# EAGLE design TimeLord-R2 (EAGLE 6.5.0)
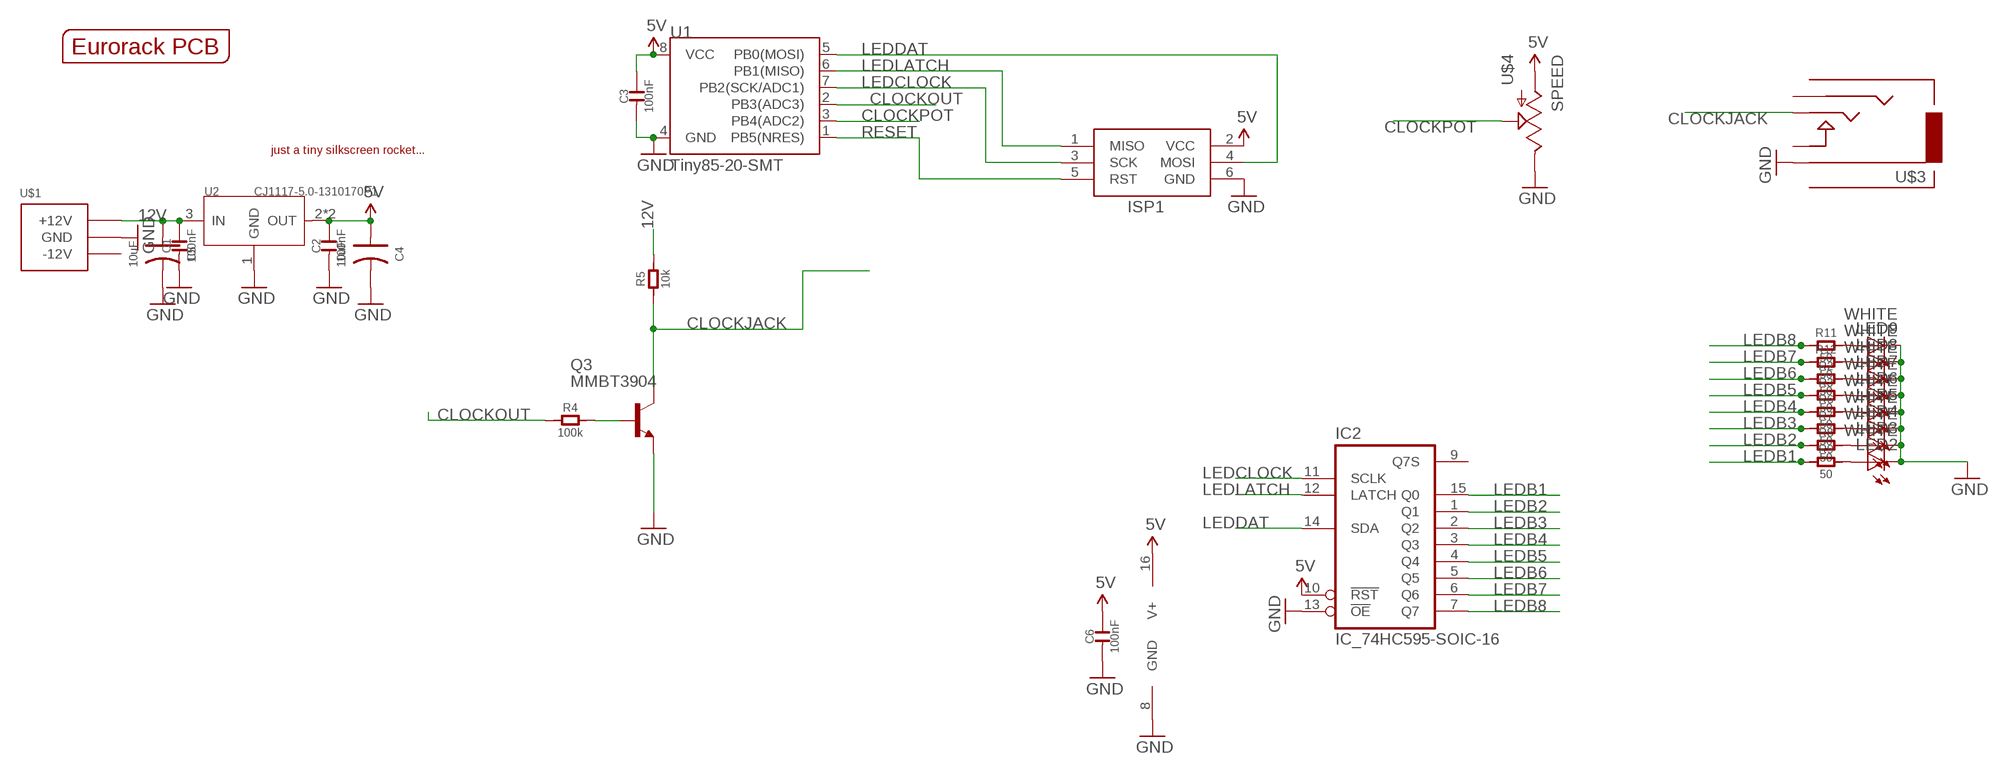
[diagram p0: schematic, sheet 1]

## Parts
C1  100nF  C-0603  [C0603]
C2  100nF  C-0603  [C0603]
C3  100nF  C-0603  [C0603]
C4  10uF  C-POLAR-A  [AVX-A]
C5  10uF  C-POLAR-A  [AVX-A]
C6  100nF  C-0603  [C0603]
IC2  IC_74HC595-SOIC-16  [SOIC-16]
ISP1  AVRISP-6  [AVRISP]
LED2  WHITE  LED3MM  [LED3MM]
LED3  WHITE  LED3MM  [LED3MM]
LED4  WHITE  LED3MM  [LED3MM]
LED5  WHITE  LED3MM  [LED3MM]
LED6  WHITE  LED3MM  [LED3MM]
LED7  WHITE  LED3MM  [LED3MM]
LED8  WHITE  LED3MM  [LED3MM]
LED9  WHITE  LED3MM  [LED3MM]
Q3  MMBT3904  MMBT3904LT1-NPN-SOT23-BEC  [SOT23-BEC]
R2  50  R-0603  [R0603]
R3  50  R-0603  [R0603]
R4  100k  R-0603  [R0603]
R5  10k  R-0603  [R0603]
R6  50  R-0603  [R0603]
R7  50  R-0603  [R0603]
R8  50  R-0603  [R0603]
R9  50  R-0603  [R0603]
R11  50  R-0603  [R0603]
R12  50  R-0603  [R0603]
U1  Tiny85-20-SMT  ATTINY45TINY85-20-SMT  [SO08-EIAJ]
U2  CJ1117-5.0-1310170P1  [SOT223]
U$1  POWER_SIMPLE10-OTHERSIDE  [POWER_10_LABELSOTHERSIDE]
U$2  EURORACK_PCB4HP  [EURORACK4HPPCB]
U$3  CLOCK  AUDIO-JACKOUTPUT  [3.5MM-JACK-SWITCH-13MM-OUTPUT]
U$4  SPEED  POTZEPHPOT  [OG-POTS_ALPS_POT_VERTICAL]
U$5  JUSTATINYROCKET  [JUSTATINYROCKET]

## Nets
5V: C2.2 C3.2 C4.+ C6.2 IC2.10(!RST) IC2.16(V+) ISP1.2(VCC) U1.8(VCC) U2.2(OUT) U2.TER(OUT) U$4.P$3(A)
12V: C1.2 C5.+ R5.2 U2.3(IN) U$1.9(+12V) U$1.10(+12V)
CLOCKJACK: Q3.C R5.1 U$3.TIP@1(TIP) U$3.TIP@2(TIP)
CLOCKOUT: R4.1 U1.2(PB3(ADC3))
CLOCKPOT: U1.3(PB4(ADC2)) U$4.P$2(S)
GND: C1.1 C2.1 C3.1 C4.- C5.- C6.1 IC2.8(GND) IC2.13(!OE) ISP1.6(GND) LED2.K(C) LED3.K(C) LED4.K(C) LED5.K(C) LED6.K(C) LED7.K(C) LED8.K(C) LED9.K(C) Q3.E U1.4(GND) U2.1(GND) U$1.3(GND) U$1.4(GND) U$1.5(GND) U$1.6(GND) U$1.7(GND) U$1.8(GND) U$3.RING@1(RING) U$3.RING@2(RING) U$4.P$1(E)
LEDB1: IC2.15(Q0) R9.1
LEDB2: IC2.1(Q1) R8.1
LEDB3: IC2.2(Q2) R7.1
LEDB4: IC2.3(Q3) R6.1
LEDB5: IC2.4(Q4) R3.1
LEDB6: IC2.5(Q5) R2.1
LEDB7: IC2.6(Q6) R12.1
LEDB8: IC2.7(Q7) R11.1
LEDCLOCK: IC2.11(SCLK) ISP1.3(SCK) U1.7(PB2(SCK/ADC1))
LEDDAT: IC2.14(SDA) ISP1.4(MOSI) U1.5(PB0(MOSI))
LEDLATCH: IC2.12(LATCH) ISP1.1(MISO) U1.6(PB1(MISO))
N$1: LED9.A R11.2
N$2: LED8.A R12.2
N$3: LED7.A R2.2
N$4: LED6.A R3.2
N$5: LED5.A R6.2
N$6: LED4.A R7.2
N$7: LED3.A R8.2
N$8: LED2.A R9.2
N$9: Q3.B R4.2
RESET: ISP1.5(RST) U1.1(PB5(NRES))
Unconnected: IC2.9(Q7S) U$1.1(-12V) U$1.2(-12V) U$3.SECOND@1(SECOND) U$3.SECOND@2(SECOND) U$3.SWITCH@1(SWITCH) U$3.SWITCH@2(SWITCH)

## Library data of the parts
C1-C3 C6 = OPL:C*
C4 C5 = OPL:C-POLAR*
IC2 = dp_devices:IC_74HC595: 8-bit serial-in parallel out shift register, output latch 3-state
ISP1 = adafruit:AVRISP: AVR ISP HEADER Standard 6 pin header for AVR programming
LED2-LED9 = SparkFun-LED:LED: LEDs Standard schematic elements and footprints for 5mm, 3mm, 1206, and 0603 sized LEDs. 5mm - Spark Fun Electronics SKU : COM-00529 (and others)
Q3 = transistor:*-NPN-: NPN Transistror BF959 corrected 2008.03.06
R2-R9 R11 R12 = OPL:R*
U1 = SparkFun-DigitalIC:ATTINY45: Atmel 8-pin 2/4/8kB flash uC; PROD_ID: IC-09092
U2 = OPL:CJ1117-5.0
U$1 = EurorackModularParts:POWER_SIMPLE
U$2 = EurorackModularParts:EURORACK_PCB
U$3 = EurorackModularParts:AUDIO-JACK: Switching Mono 3.5mm Audio Jack from Erthenvar.
U$4 = EurorackModularParts:POT
U$5 = zephod-components:JUSTATINYROCKET

## Net classes
0 default: width 0.381 mm

## Board
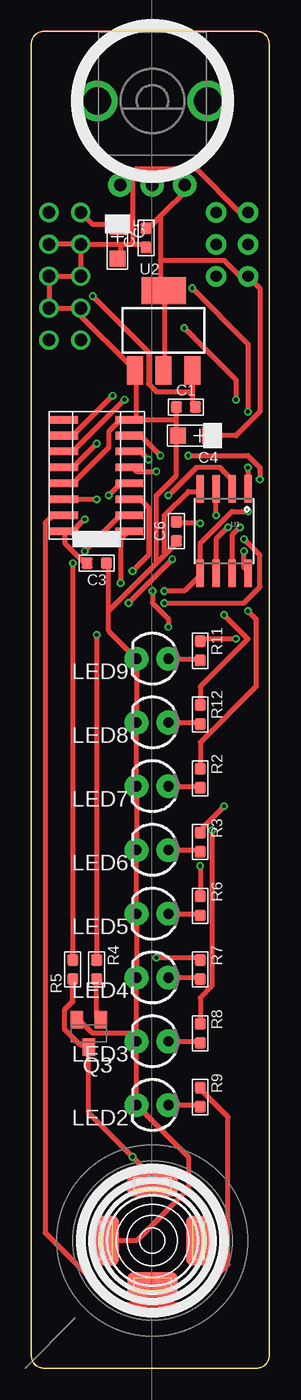
[diagram p1: board, top side]
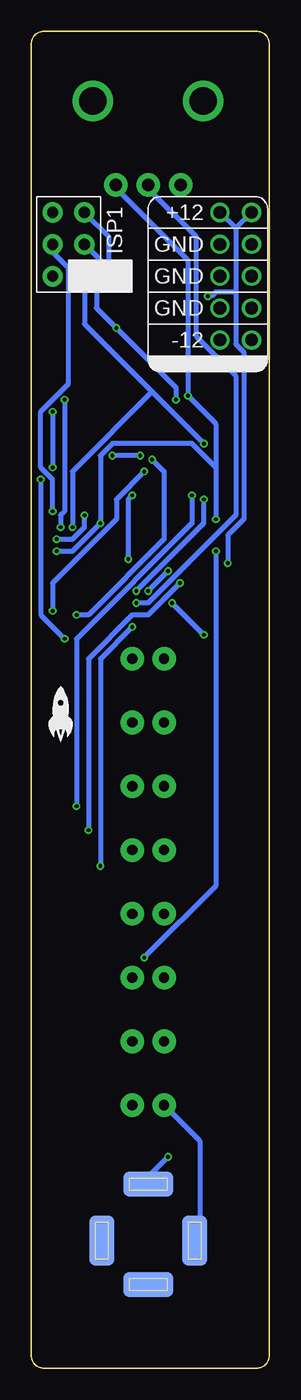
[diagram p2: board, bottom side, seen from below]

Size 18.98 x 106.5 mm. Coordinates in mm from the lower left corner, seen from the top.
Copper layers (1*16): Top 0.035mm / dielectric 1.5mm / Bottom 0.035mm
Design rules "ITEADstudio_DRC": minimum track width 6mil, minimum drill 12mil, track to track 6mil, track to pad 6mil, pad to pad 6mil, via to via 6mil, smd to smd 0mil, copper to edge 10mil, drill to drill 10mil, minimum pad ring 10mil, minimum via ring 6mil, stop-mask expansion 2mil, vias tented up to drill 100mil, thermal gap 10mil

### Footprints (pad centres in the part's own frame; a part is rotated, then mirrored left to right if it is on the bottom)
C0603 = smd 0.889 x 0.889: 1 -0.762,0; 2 0.762,0
AVX-A = smd 1.27 x 1.27: + -1.27,0; - 1.27,0
SOIC-16 = smd 0.6 x 2.2: 1 -4.445,-2.6; 2 -3.175,-2.6; 3 -1.905,-2.6; 4 -0.635,-2.6; 5 0.635,-2.6; 6 1.905,-2.6; 7 3.175,-2.6; 8 4.445,-2.6; 9 4.445,2.6; 10 3.175,2.6; 11 1.905,2.6; 12 0.635,2.6; 13 -0.635,2.6; 14 -1.905,2.6; 15 -3.175,2.6; 16 -4.445,2.6
AVRISP = drill 0.9 pad 1.626: 1 -1.27,2.54; 2 1.27,2.54; 3 -1.27,0; 4 1.27,0; 5 -1.27,-2.54; 6 1.27,-2.54
LED3MM = drill 0.813 pad 1.88: A -1.27,0; K 1.27,0
SOT23-BEC = smd 1 x 1.4: B -0.95,-1.1; C 0,1.1; E 0.95,-1.1
R0603 = smd 0.889 x 0.889: 1 -0.762,0; 2 0.762,0
SO08-EIAJ = smd 0.61 x 2.21: 1 -1.905,-3.378; 2 -0.635,-3.378; 3 0.635,-3.378; 4 1.905,-3.378; 5 1.905,3.353; 6 0.635,3.353; 7 -0.635,3.353; 8 -1.905,3.353
SOT223 = smd 1.27 x 2.286: 1 -2.286,-3.175; 2 0,-3.175; 3 2.286,-3.175 | smd 3.556 x 2.159: TER 0,3.175
POWER_10_LABELSOTHERSIDE = drill 1.016: 1 -5.08,-1.27; 2 -5.08,1.27; 3 -2.54,-1.27; 4 -2.54,1.27; 5 0,-1.27; 6 0,1.27; 7 2.54,-1.27; 8 2.54,1.27; 9 5.08,-1.27; 10 5.08,1.27
3.5MM-JACK-SWITCH-13MM-OUTPUT = smd 2 x 4: RING@1 -3.7,0; SWITCH@1 3.7,0 | smd 2 x 4 bottom: RING@2 -3.7,0; SWITCH@2 3.7,0 | smd 4 x 2: SECOND@1 0,-3.5; TIP@1 0,4.5 | smd 4 x 2 bottom: SECOND@2 0,-3.5; TIP@2 0,4.5
OG-POTS_ALPS_POT_VERTICAL = drill 1 pad 1.88: P$1 -2.58,-6.7; P$2 0,-6.7; P$3 2.58,-6.7 | drill 2.2 pad 3.175: P$4 4.4,0; P$5 -4.4,0

### Placement (x,y rotation side)
C1  12.33,76.58 0 top
C2  9.15,90.04 90 top
C3  5.21,64.14 180 top
C4  12.96,74.3 180 top
C5  6.87,89.66 270 top
C6  11.56,66.67 90 top
IC2  5.21,71.12 90 top
ISP1  16.01,89.53 180 bottom
LED2  9.66,20.95 180 top
LED3  9.66,26.04 180 top
LED4  9.66,31.11 180 top
LED5  9.66,36.2 180 top
LED6  9.66,41.27 180 top
LED7  9.66,46.35 180 top
LED8  9.66,51.44 180 top
LED9  9.66,56.52 180 top
Q3  4.58,26.67 180 top
R2  13.47,46.99 270 top
R3  13.47,41.91 270 top
R4  5.21,31.75 270 top
R5  3.31,31.75 90 top
R6  13.47,36.83 270 top
R7  13.47,31.75 270 top
R8  13.47,26.67 270 top
R9  13.47,21.59 270 top
R11  13.47,57.15 270 top
R12  13.47,52.07 270 top
U1  15.38,66.67 180 top
U2  10.55,82.68 0 top
U$1  2.67,87 90 bottom
U$2  -0.5,0 0 top
U$3  9.66,10.16 0 top
U$4  9.66,100.97 0 top
U$5  16.64,52.07 0 bottom

### Tracks (layer width: path | path; a pad name or v marks a point on that pad's centre or on a via)
5V  (via drill 0.3)
  Top 0.381: C4.+ 16.33,74.3 18.23,76.2 18.23,86.04 ISP1.2 16.64,87 15.38,88.27 10.29,88.27 | U2.2 10.61,79.69 10.61,85.72 U2.TER 10.29,86.04 10.29,88.27 | v13.47,67.31 11.56,67.31 C6.2 | v16.96,65.09 16.96,63.82 17.28,63.5 U1.8 | 2.67,66.67 2.67,65.72 4.26,64.14 C3.2 | 10.29,91.76 12.52,93.98 U$4.P$3 | 10.29,91.76 9.34,90.81 C2.2 | IC2.10 3.31,74.3 v6.49,77.47 | 2.67,66.67 3.31,66.67 v4.26,67.63 | 2.67,66.67 IC2.16 | 10.29,91.76 10.29,88.27
  Bottom 0.381: v16.96,65.09 15.69,65.09 v13.47,67.31 13.47,72.71 12.52,73.66 6.17,73.66 4.26,71.75 | U$4.P$3 12.2,93.98 6.49,88.27 v6.49,77.47 4.26,75.25 4.26,71.75 | 4.26,71.75 v4.26,67.63
12V  (via drill 0.3)
  Top 0.381: U$1.10 4.9,91.12 6.8,91.12 C5.+ | U2.3 12.84,77.79 | 12.84,77.79 12.84,76.83 C1.2 | v3.31,64.14 R5.2 | 12.84,77.79 9.98,77.79 9.34,78.42 9.34,80.96 v4.9,85.41
  Bottom 0.381: v3.31,64.14 3.31,66.36 2.04,67.63 2.04,80.96 2.67,81.6 2.67,85.72 | 2.67,90.81 2.67,85.72 | U$1.9 2.67,90.81 | v4.9,85.41 4.58,85.41 4.26,85.72 2.67,85.72 | 2.67,90.81 U$1.10
CLOCKJACK  (via drill 0.3)
  Top 0.381: R5.1 3.31,29.21 2.67,28.57 2.67,26.99 3.95,25.72 4.58,25.72 Q3.C 4.58,20.32 v8.07,16.83 9.66,15.24 U$3.TIP@2
  Bottom 0.381: v8.07,16.83 9.66,15.24 U$3.TIP@2
CLOCKOUT  (via drill 0.3)
  Top 0.381: v5.21,58.42 R4.1 | v11.25,64.45 v7.76,60.96 | v10.93,69.53 13.15,71.75 15.06,71.75 16.01,70.8 U1.2
  Bottom 0.381: v7.76,60.96 v5.21,58.42 | v11.25,64.45 11.25,69.22 v10.93,69.53
CLOCKPOT  (via drill 0.3)
  Top 0.381: v14.74,67.94 U1.3 | v16.96,66.04 18.23,64.77 18.23,62.23 16.96,60.96 v10.61,60.96
  Bottom 0.381: v14.74,67.94 14.74,66.99 15.69,66.04 v16.96,66.04 | v10.61,60.96 9.66,60.96 2.67,67.94 2.67,79.06 5.85,82.23 5.85,90.17 9.66,93.98 U$4.P$2
GND
  Top 0.381: 11.56,74.3 11.56,75.56 | 11.56,75.56 C1.1 | IC2.8 8.39,75.56 | 8.39,75.56 11.56,75.56 | IC2.13 3.31,70.48 6.17,73.34 6.17,74.61 7.12,75.56 IC2.8 | 8.39,75.56 8.39,79.38 U2.1 3.31,84.45 | 8.07,75.56 IC2.8 | 3.31,84.45 U$1.3 U$1.5 U$1.6 U$1.8 | U$1.8 7.12,89.53 | 7.12,89.53 8.07,89.53 | 8.07,89.53 9.03,89.53 C2.1 | 7.12,89.53 7.12,88.58 C5.- | U$1.8 U$1.7 | ISP1.6 16.64,92.08 13.15,95.57 8.39,95.57 8.07,95.25 | 8.07,95.25 7.12,94.3 U$4.P$1 | 8.07,95.25 8.07,89.53 | 3.31,84.45 U$1.4 | 6.17,60.33 6.17,58.74 LED9.K LED8.K LED7.K LED6.K LED5.K LED4.K LED3.K | 6.17,60.33 6.17,64.14 C3.1 | 6.17,60.33 9.98,64.14 | 9.98,64.14 10.61,64.77 | 10.61,64.77 11.56,65.72 C6.1 | 10.61,64.77 10.61,67.94 12.52,69.85 13.47,69.85 U1.4 | Q3.E 3.95,27.62 4.9,26.67 7.76,26.67 LED3.K | U$3.RING@1 8.39,10.16 12.52,14.29 12.52,16.83 LED2.K LED3.K | 11.56,74.3 11.56,71.12 9.98,69.53 9.98,64.14 | 11.56,74.3 C4.-
  Bottom 0.381: U$3.RING@1 5.53,10.16 5.53,18.1 LED2.K
LEDB1
  Top 0.381: IC2.15 1.72,67.94 1.09,67.31 1.09,10.79 6.8,5.08 12.52,5.08 15.69,8.26 15.69,20 13.47,22.23 R9.1
LEDB2  (via drill 0.3)
  Top 0.381: R8.1 13.47,29.53 14.42,30.48 v14.42,42.86 | v7.12,62.55 7.12,66.04 7.76,66.67 IC2.1
  Bottom 0.381: v14.42,42.86 14.42,56.52 10.93,60.01 9.66,60.01 v7.12,62.55
LEDB3  (via drill 0.3)
  Top 0.381: v9.98,32.7 13.47,32.7 R7.1 | v4.26,65.09 7.12,67.94 IC2.2
  Bottom 0.381: v9.98,32.7 4.26,38.42 v4.26,65.09
LEDB4  (via drill 0.3)
  Top 0.381: v13.47,40.01 R6.1 | v10.93,59.05 10.93,59.69 9.66,60.96 v9.66,61.91 | v8.07,63.5 9.34,64.77 9.34,68.58 8.71,69.22 IC2.3
  Bottom 0.381: v13.47,40.01 13.47,56.52 v10.93,59.05 | v8.07,63.5 v9.66,61.91
LEDB5  (via drill 0.3)
  Top 0.381: v15.38,44.77 13.47,42.86 R3.1 | v6.17,69.53 7.12,70.48 IC2.4
  Bottom 0.381: v15.38,44.77 15.38,58.1 6.17,67.31 v6.17,69.53
LEDB6  (via drill 0.3)
  Top 0.381: R2.1 13.47,49.85 17.91,54.29 17.91,59.69 v17.28,60.33 | v9.98,71.44 8.39,71.44 8.07,71.75 IC2.5
  Bottom 0.381: v17.28,60.33 17.28,62.55 12.2,67.63 12.2,69.22 v9.98,71.44
LEDB7  (via drill 0.3)
  Top 0.381: R12.1 13.47,54.29 17.28,58.1 v15.38,60.01 | v9.34,72.39 8.71,73.03 IC2.6
  Bottom 0.381: v15.38,60.01 14.42,60.01 8.39,66.04 8.39,71.44 v9.34,72.39
LEDB8  (via drill 0.3)
  Top 0.381: v16.33,58.1 13.47,58.1 R11.1 | v18.23,70.8 18.23,71.75 17.28,72.71 v12.52,72.71 | v10.29,72.71 8.71,74.3 IC2.7
  Bottom 0.381: v16.33,58.1 18.23,60.01 v18.23,70.8 | v10.29,72.71 v12.52,72.71
LEDCLOCK  (via drill 0.3)
  Top 0.381: IC2.11 3.31,73.03 v7.44,77.15 | U1.7 16.01,66.36 v16.64,66.99 | v16.33,77.15 16.33,78.74 v12.2,82.87
  Bottom 0.381: v7.44,77.15 7.44,78.11 v12.2,82.87 13.79,84.45 13.79,86.04 13.47,86.36 13.47,88.27 ISP1.3 | v16.64,66.99 16.64,67.94 16.33,68.26 v16.33,77.15
LEDDAT  (via drill 0.3)
  Top 0.381: v5.21,69.22 IC2.14 | v10.61,61.91 12.2,61.91 13.47,63.18 U1.5 13.47,65.72 16.01,68.26 v17.28,68.26
  Bottom 0.381: v5.21,69.22 5.21,67.31 v10.61,61.91 | ISP1.4 17.28,88.9 16.01,87.63 16.01,78.42 18.23,76.2 18.23,71.75 17.28,70.8 v17.28,68.26
LEDLATCH  (via drill 0.3)
  Top 0.381: IC2.12 3.31,71.75 v5.21,73.66 | U1.6 14.74,66.04 v15.69,66.99
  Bottom 0.381: 9.34,77.79 14.74,83.19 ISP1.1 | 9.34,77.79 v5.21,73.66 | v15.69,66.99 15.69,71.44 9.34,77.79
N$1
  Top 0.381: LED9.A 13.47,56.52 R11.2
N$2
  Top 0.381: LED8.A 13.47,51.44 R12.2
N$3
  Top 0.381: LED7.A 13.47,46.35 R2.2
N$4
  Top 0.381: LED6.A 13.47,41.27 R3.2
N$5
  Top 0.381: LED5.A 13.47,36.2 R6.2
N$6
  Top 0.381: LED4.A 13.47,31.11 R7.2
N$7
  Top 0.381: LED3.A 13.47,26.04 R8.2
N$8
  Top 0.381: LED2.A 13.47,20.95 R9.2
N$9
  Top 0.381: R4.2 5.21,27.94 Q3.B
RESET  (via drill 0.3)
  Top 0.381: v17.28,71.75 U1.1 | v17.28,76.2 17.28,81.6 v12.84,86.04
  Bottom 0.381: v17.28,76.2 v17.28,71.75 | v12.84,86.04 12.84,90.17 ISP1.5